# Altium schematic sheet untitled.SchDoc
size 482 x 195 mm
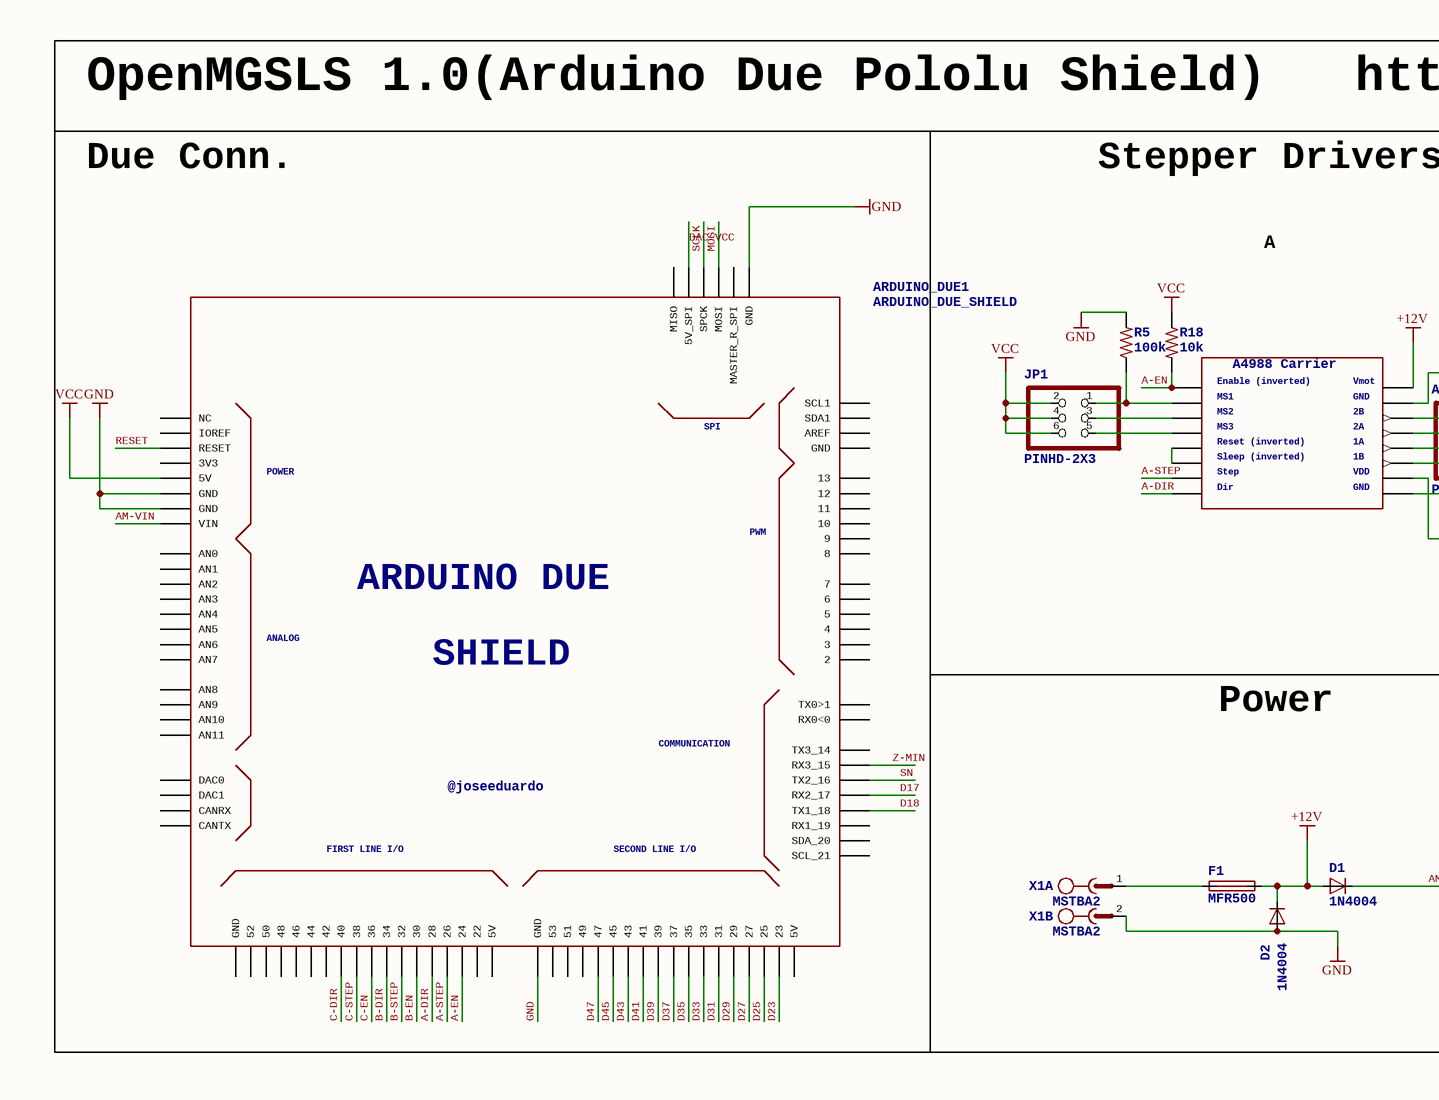
[diagram p0: untitled.SchDoc, left]
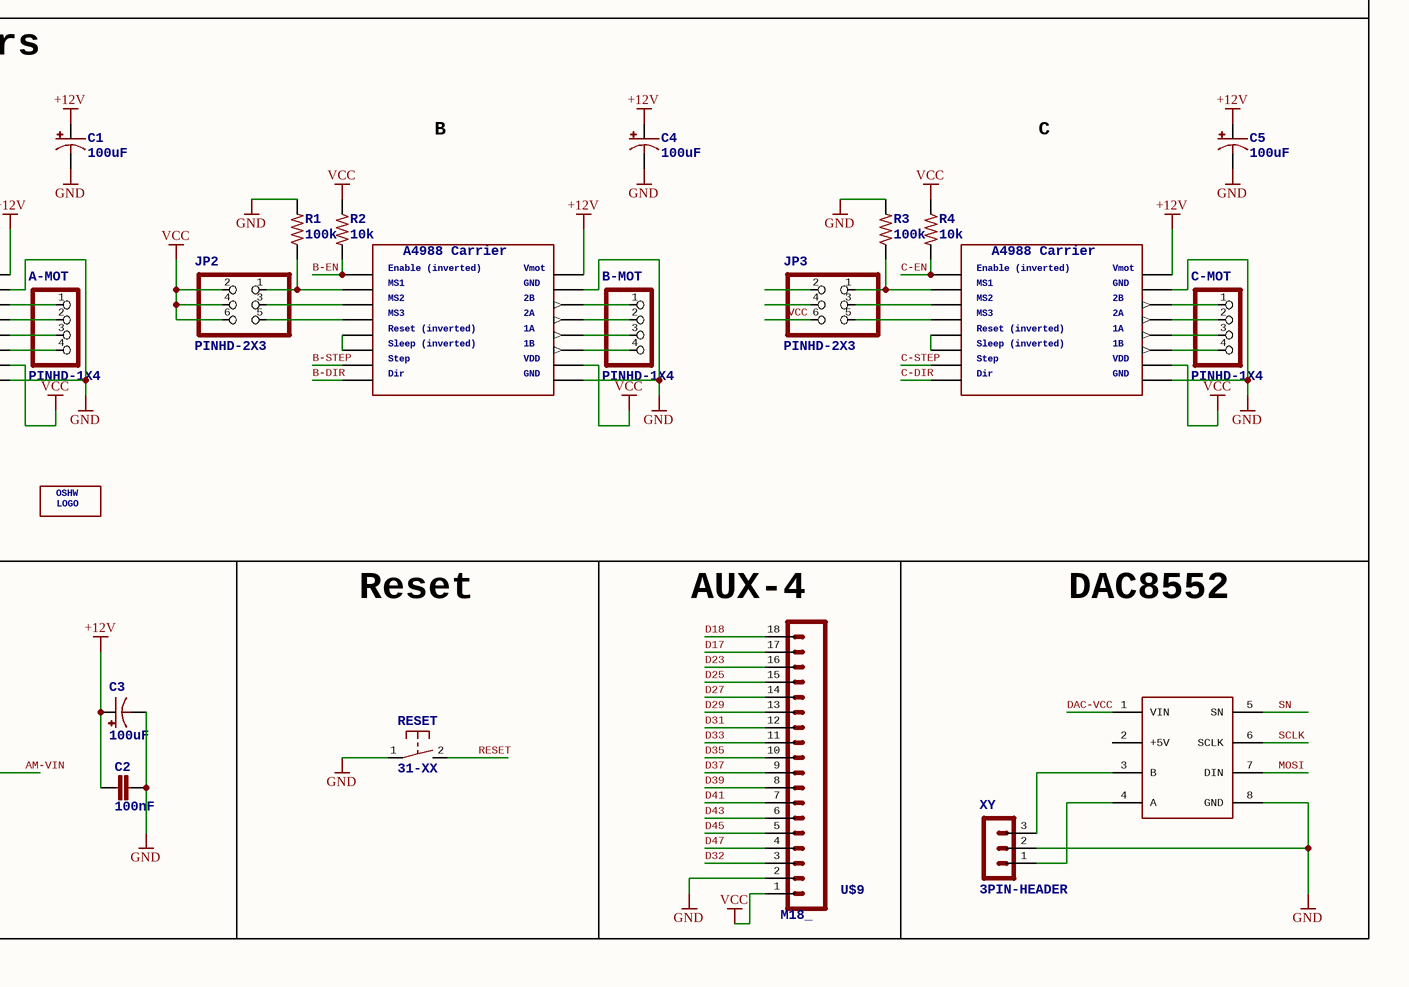
[diagram p1: untitled.SchDoc, right]

## Parts
A-MOT  PINHD-1X4  [1X04]
ARDUINO_DUE1  ARDUINO_DUE_SHIELD  ARDUINODUE: ARDUINO DUE  FIRSTLINEI/O: FIRST LINE I/O  SECONDLINEI/O: SECOND LINE I/O  [ARDUINO_DUE_SHIELD]
B-MOT  PINHD-1X4  [1X04]
C1  100uF  [153CLV-0605]
C2  100nF  [C0805]
C3  100uF  [153CLV-0605]
C4  100uF  [153CLV-0605]
C5  100uF  [153CLV-0605]
C-MOT  PINHD-1X4  [1X04]
D1  1N4004  [DO41-10]
D2  1N4004  [DO41-10]
F1  MFR500  [MFR500]
JP1  PINHD-2X3  [2X03]
JP2  PINHD-2X3  [2X03]
JP3  PINHD-2X3  [2X03]
LOGO1  OSHW_LOGO_6MILX0200-NT  [OSHW_6X200_NOTEXT]  (value not drawn)
R1  100k  [R0805]
R2  10k  [R0805]
R3  100k  [R0805]
R4  10k  [R0805]
R5  100k  [R0805]
R18  10k  [R0805]
RESET  31-XX  [B3F-31XX]
U$1  Enable(inverted): Enable (inverted)  Reset(inverted): Reset (inverted)  Sleep(inverted): Sleep (inverted)  A4988Carrier: A4988 Carrier  [A4988BREAKOUT]  (hidden comment: A4988BREAKOUT)
U$2  DAC8552  [DAC8552]  (value not drawn)
U$3  Enable(inverted): Enable (inverted)  Reset(inverted): Reset (inverted)  Sleep(inverted): Sleep (inverted)  A4988Carrier: A4988 Carrier  [A4988BREAKOUT]  (hidden comment: A4988BREAKOUT)
U$6  Enable(inverted): Enable (inverted)  Reset(inverted): Reset (inverted)  Sleep(inverted): Sleep (inverted)  A4988Carrier: A4988 Carrier  [A4988BREAKOUT]  (hidden comment: A4988BREAKOUT)
U$9  M18_  [1X18]
X1  MSTBA2  [MSTBA2]  (parts A,B of 2)
XY  3PIN-HEADER  [3PIN-HEADER]

## Nets
+12V: C1.+ C2.1 C3.+ C4.+ C5.+ D1.A D2.C F1.1 U$1.VMOT U$3.VMOT U$6.VMOT
GND: ARDUINO_DUE1.GND ARDUINO_DUE1.GND_1(GND) ARDUINO_DUE1.GND_3(GND) ARDUINO_DUE1.GND_5(GND) C1.- C2.2 C3.- C4.- C5.- D2.A R1.2 R3.2 R5.2 RESET.1(P) U$1.GND U$1.GND@0(GND) U$2.8(GND) U$3.GND U$3.GND@0(GND) U$6.GND U$6.GND@0(GND) U$9.2 X1.2 XY.2
VCC: ARDUINO_DUE1.5V0(5V) JP1.2 JP1.4 JP1.6 JP2.2 JP2.4 JP2.6 JP3.6 R2.1 R4.1 R18.1 U$1.VDD U$3.VDD U$6.VDD U$9.1
A-DIR: ARDUINO_DUE1.28 U$6.DIR
A-EN: ARDUINO_DUE1.24 R18.2 U$6.EN
A-STEP: ARDUINO_DUE1.26 U$6.STEP
AM-VIN: ARDUINO_DUE1.VIN D1.C
B-DIR: ARDUINO_DUE1.34 U$1.DIR
B-EN: ARDUINO_DUE1.30 R2.2 U$1.EN
B-STEP: ARDUINO_DUE1.32 U$1.STEP
C-DIR: ARDUINO_DUE1.40 U$3.DIR
C-EN: ARDUINO_DUE1.36 R4.2 U$3.EN
C-STEP: ARDUINO_DUE1.38 U$3.STEP
D17: ARDUINO_DUE1.17(RX2_17) U$9.17
D18: ARDUINO_DUE1.18(TX1_18) U$9.18
D23: ARDUINO_DUE1.23 U$9.16
D25: ARDUINO_DUE1.25 U$9.15
D27: ARDUINO_DUE1.27 U$9.14
D29: ARDUINO_DUE1.29 U$9.13
D31: ARDUINO_DUE1.31 U$9.12
D32: U$9.3
D33: ARDUINO_DUE1.33 U$9.11
D35: ARDUINO_DUE1.35 U$9.10
D37: ARDUINO_DUE1.37 U$9.9
D39: ARDUINO_DUE1.39 U$9.8
D41: ARDUINO_DUE1.41 U$9.7
D43: ARDUINO_DUE1.43 U$9.6
D45: ARDUINO_DUE1.45 U$9.5
D47: ARDUINO_DUE1.47 U$9.4
DAC-VCC: ARDUINO_DUE1.5V_2(5V_SPI) U$2.1(VIN)
MOSI: ARDUINO_DUE1.MOSI U$2.7(DIN)
RESET: ARDUINO_DUE1.RESET RESET.2(S)
SCLK: ARDUINO_DUE1.SPCK U$2.6(SCLK)
SN: ARDUINO_DUE1.16(TX2_16) U$2.5(SN)
Z-MIN: ARDUINO_DUE1.15(RX3_15)
NetA-MOT_1: A-MOT.1 U$6.2B
NetA-MOT_2: A-MOT.2 U$6.2A
NetA-MOT_3: A-MOT.3 U$6.1A
NetA-MOT_4: A-MOT.4 U$6.1B
NetB-MOT_1: B-MOT.1 U$1.2B
NetB-MOT_2: B-MOT.2 U$1.2A
NetB-MOT_3: B-MOT.3 U$1.1A
NetB-MOT_4: B-MOT.4 U$1.1B
NetC-MOT_1: C-MOT.1 U$3.2B
NetC-MOT_2: C-MOT.2 U$3.2A
NetC-MOT_3: C-MOT.3 U$3.1A
NetC-MOT_4: C-MOT.4 U$3.1B
NetF1_2: F1.2 X1.1
NetJP1_1: JP1.1 R5.1 U$6.MS1
NetJP1_3: JP1.3 U$6.MS2
NetJP1_5: JP1.5 U$6.MS3
NetJP2_1: JP2.1 R1.1 U$1.MS1
NetJP2_3: JP2.3 U$1.MS2
NetJP2_5: JP2.5 U$1.MS3
NetJP3_1: JP3.1 R3.1 U$3.MS1
NetJP3_3: JP3.3 U$3.MS2
NetJP3_5: JP3.5 U$3.MS3
NetU$1_RST: U$1.RST U$1.SLP(SLEEP)
NetU$2_3: U$2.3(B) XY.3
NetU$2_4: U$2.4(A) XY.1
NetU$3_RST: U$3.RST U$3.SLP(SLEEP)
NetU$6_RST: U$6.RST U$6.SLP(SLEEP)

Not connected (* = marked no-connect by the designer): ARDUINO_DUE1 0(RX0<0) 1(TX0>1) 2 3 3V3 4 5 5V0_1(5V) 5V0_2(5V) 6 7 8 9 10 11 12 13 14(TX3_14) 19(RX1_19) 20(SDA_20) 21(SCL_21) 22 42 44 46 48 49 50 51 52 53 A0(AN0) A1(AN1) A2(AN2) A3(AN3) A4(AN4) A5(AN5) A6(AN6) A7(AN7) A8(AN8) A9(AN9) A10(AN10) A11(AN11) AREF CANRX CANTX DAC0 DAC1 GND_2(GND) GND_4(GND) IOREF MASTER_RESET_SPI(MASTER_R_SPI) MISO NC_2(NC) SCL1 SDA1; JP3 2 4; U$2 2(+5V)

## Notes on the sheet
- OpenMGSLS 1.0(Arduino Due Pololu Shield)   https://github.com/QiayuanLiao/OpenMGSLS
- Due Conn.
- Stepper Drivers
- A
- B
- C
- Power
- Reset
- (near U$9) AUX-4
- DAC8552

## Library data of the parts
A-MOT B-MOT C-MOT = PINHD-1X4: PIN HEADER
C1 C3-C5 = CPOL-US153CLV-0605: POLARIZED CAPACITOR, American symbol
C2 = C-EUC0805: CAPACITOR, European symbol
D1 D2 = 1N4004: DIODE   general purpose rectifier, 1 A
F1 = PTCFUSE: LITTLEFUSE   Picofuse/slow Littlefuse
JP1-JP3 = PINHD-2X3: PIN HEADER
R1-R5 R18 = R-US_R0805: RESISTOR, American symbol
RESET = 31-XX: OMRON SWITCH; MPN: B3F-3100; OC_FARNELL: 959704; OC_NEWARK: 36M3582
X1 = MSTBA2: PHOENIX; MPN: 1757242; MF: FARNELL; OC_FARNELL: 3705171; OC_NEWARK: 71C4161
XY = 3PIN-HEADER: PIN HEADER
ARDUINO_DUE1 = ARDUINO_DUE_SHIELD: SHIELD: SHIELD; PWM: PWM; POWER: POWER; ANALOG: ANALOG; COMMUNICATION: COMMUNICATION; SPI: SPI; @joseeduardo: @joseeduardo
LOGO1 = OSHW_LOGO_6MILX0200-NT: OSHW: OSHW; LOGO: LOGO
U$1 U$3 U$6 = A4988BREAKOUT: GND: GND; MS1: MS1; MS2: MS2; MS3: MS3; Step: Step; Dir: Dir; VDD: VDD; Vmot: Vmot; 2B: 2B; 2A: 2A; 1A: 1A; 1B: 1B